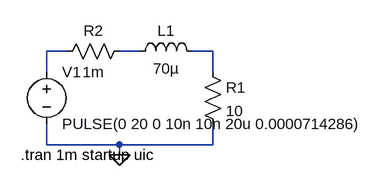
[diagram p0: schematic Draft5.asc]
Draft5.asc, the LTspice schematic file:
Version 4.1
SHEET 1 1772 680
WIRE 1280 -512 1248 -512
WIRE 1392 -512 1360 -512
WIRE 1504 -512 1472 -512
WIRE 1248 -480 1248 -512
WIRE 1504 -480 1504 -512
WIRE 1248 -368 1248 -400
WIRE 1360 -368 1248 -368
WIRE 1504 -368 1504 -400
WIRE 1504 -368 1360 -368
WIRE 1360 -352 1360 -368
FLAG 1360 -352 0
SYMBOL voltage 1248 -496 R0
WINDOW 123 0 0 Left 0
WINDOW 39 0 0 Left 0
SYMATTR InstName V1
SYMATTR Value PULSE(0 20 0 10n 10n 20u 0.0000714286)
SYMBOL ind 1376 -496 R270
WINDOW 0 32 56 VTop 2
WINDOW 3 5 56 VBottom 2
SYMATTR InstName L1
SYMATTR Value 70µ
SYMATTR SpiceLine Rser=0.159
SYMBOL res 1488 -496 R0
SYMATTR InstName R1
SYMATTR Value 10
SYMBOL res 1264 -496 R270
WINDOW 0 32 56 VTop 2
WINDOW 3 0 56 VBottom 2
SYMATTR InstName R2
SYMATTR Value 1m
TEXT 1208 -352 Left 2 !.tran 1m startup uic

The netlist it stands for:
* Draft5.asc
V1 N001 0 PULSE(0 20 0 10n 10n 20u 0.0000714286)
L1 N002 N003 70µ Rser=0.159
R1 N003 0 10
R2 N001 N002 1m
.tran 1m startup uic
.backanno
.end